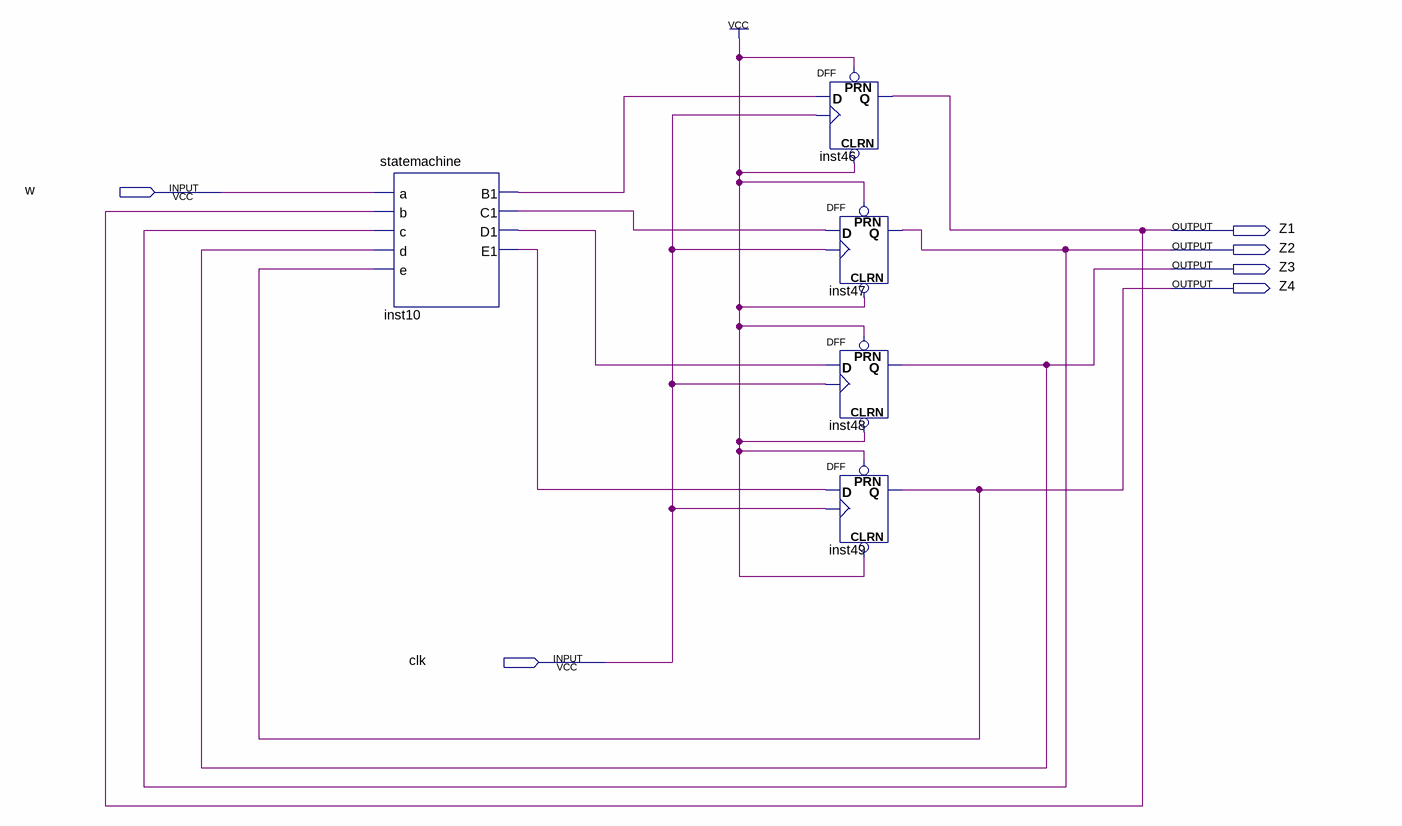
[diagram p0: schematic sheet]
// Quartus schematic FProject.bdf as structural Verilog: 5 symbols, 6 pins
module FProject (
  input  w,
  input  clk,
  output Z1,
  output Z2,
  output Z3,
  output Z4
);

  wire inst10_b1, inst10_c1, inst10_d1, inst10_e1;

  statemachine inst10 (
    .a(w), .b(Z1), .c(Z2), .d(Z3), .e(Z4), .B1(inst10_b1), .C1(inst10_c1), .D1(inst10_d1), .E1(inst10_e1));
  DFF inst46 (.CLRN(1'b1), .CLK(clk), .D(inst10_b1), .PRN(1'b1), .Q(Z1));
  DFF inst47 (.CLRN(1'b1), .CLK(clk), .D(inst10_c1), .PRN(1'b1), .Q(Z2));
  DFF inst48 (.CLRN(1'b1), .CLK(clk), .D(inst10_d1), .PRN(1'b1), .Q(Z3));
  DFF inst49 (.CLRN(1'b1), .CLK(clk), .D(inst10_e1), .PRN(1'b1), .Q(Z4));
endmodule
